# EAGLE design placas_leds (EAGLE 7.7.0)
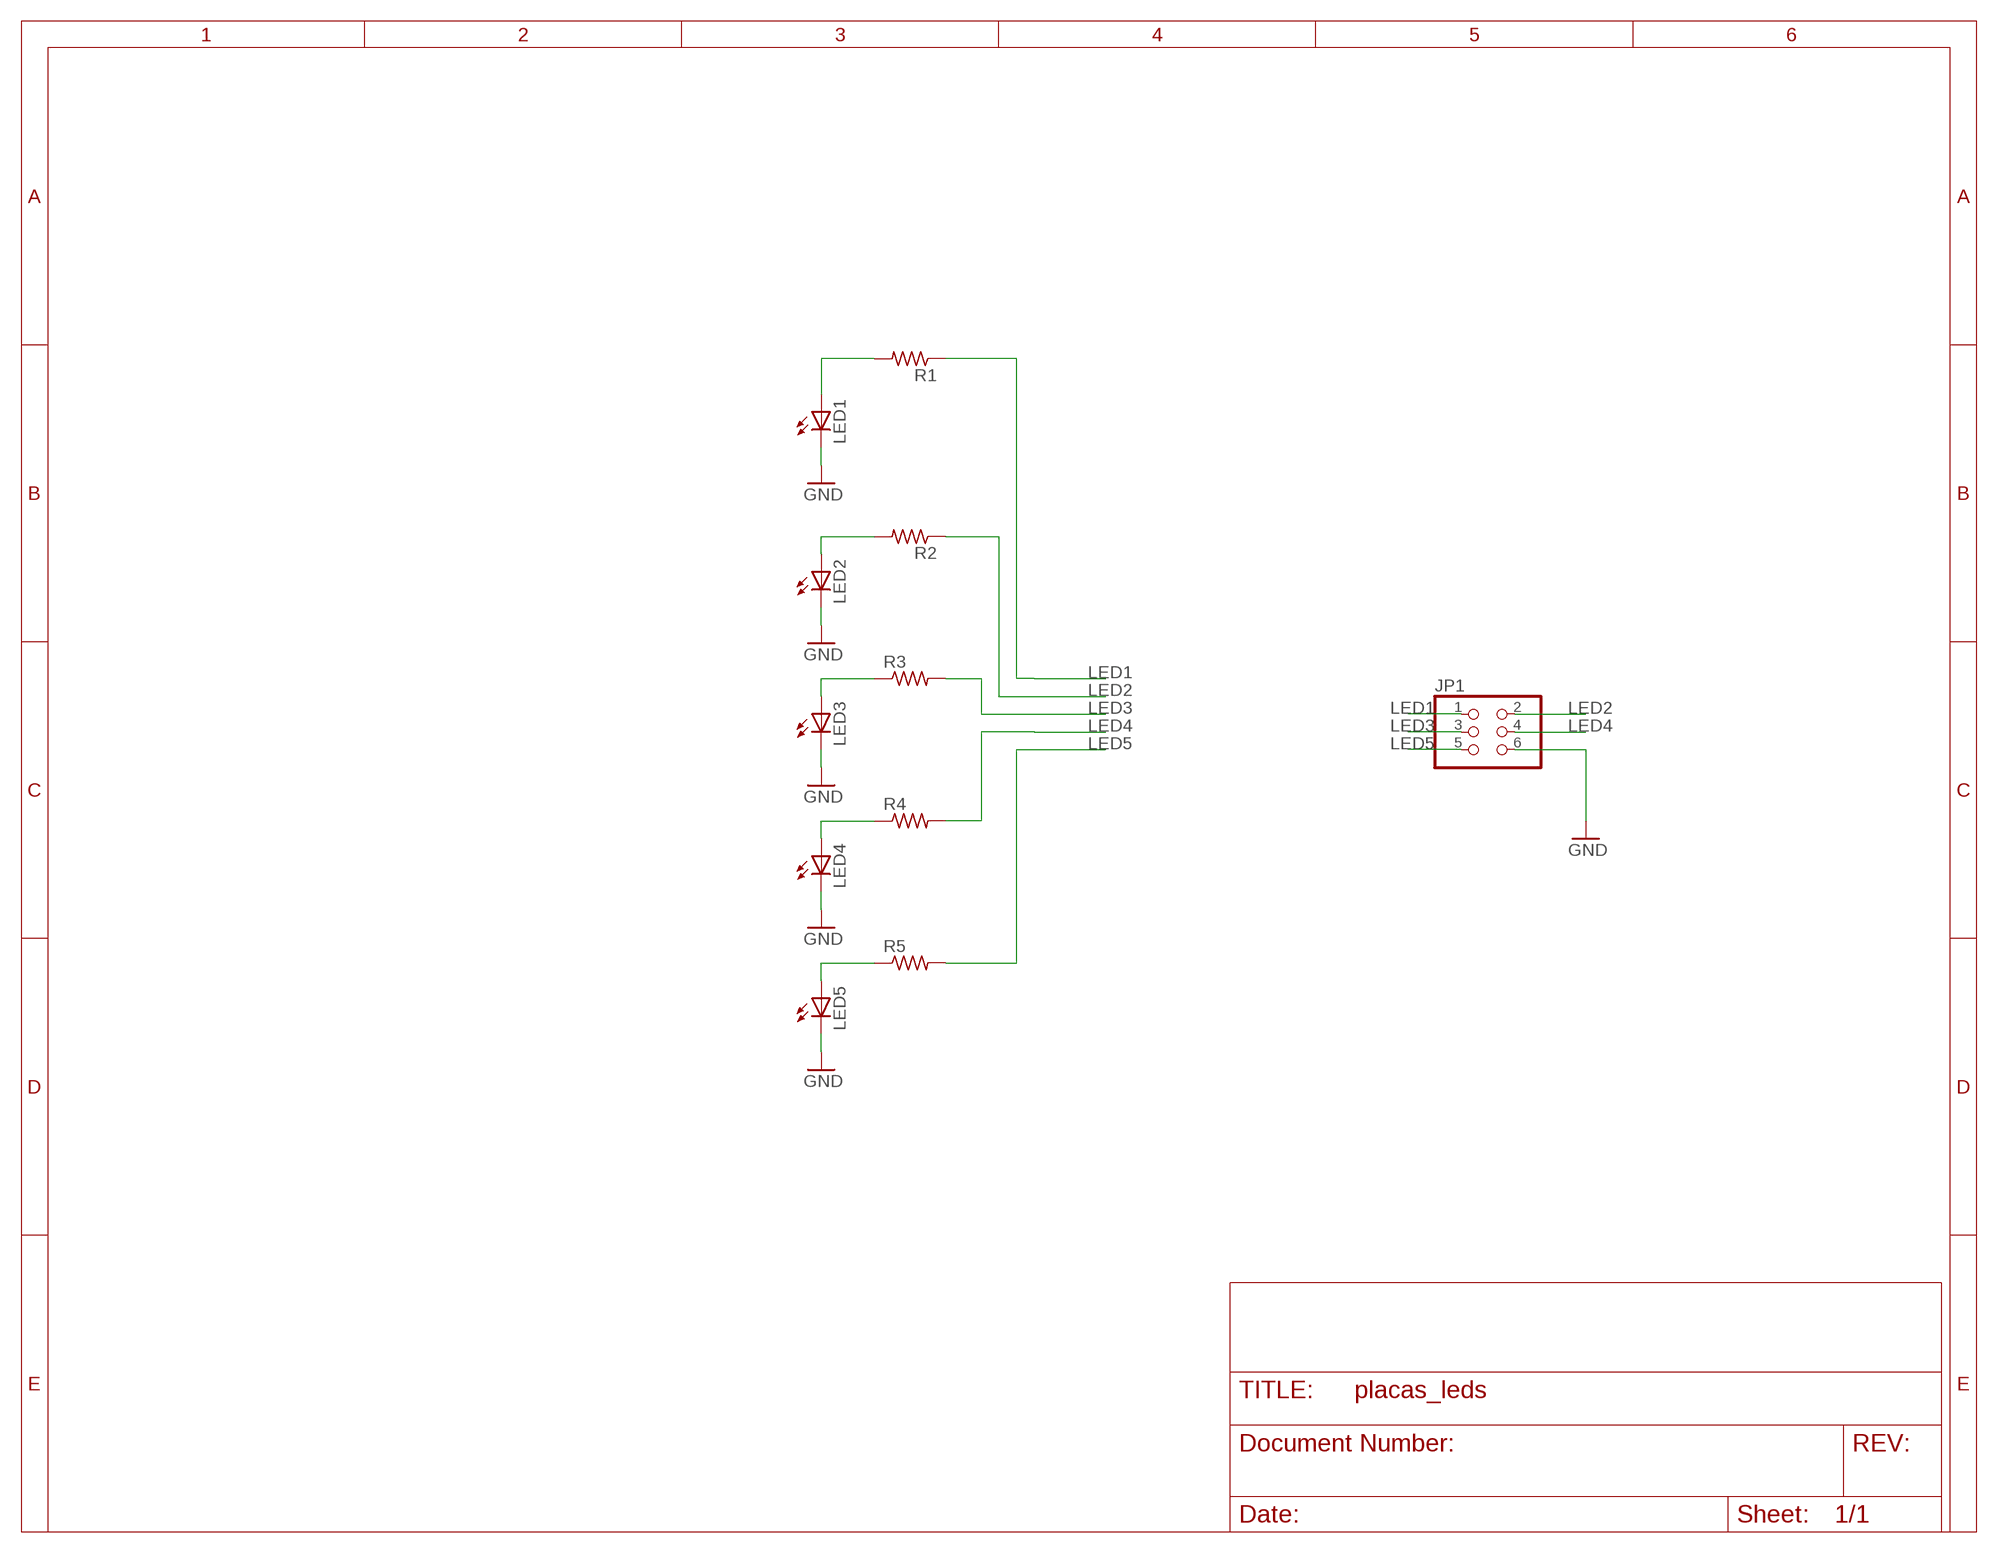
[diagram p0: schematic, sheet 1]

## Parts
JP1  PINHD-2X3  [2X03]
LED1  LED5MM  [LED5MM]
LED2  LED5MM  [LED5MM]
LED3  LED5MM  [LED5MM]
LED4  LED5MM  [LED5MM]
LED5  LED5MM  [LED5MM]
R1  R-US_0207/9  [0207/9]
R2  R-US_0207/9  [0207/9]
R3  R-US_0207/9  [0207/9]
R4  R-US_0207/9  [0207/9]
R5  R-US_0207/9  [0207/9]

## Nets
GND: JP1.6 LED1.K(C) LED2.K(C) LED3.K(C) LED4.K(C) LED5.K(C)
LED1: JP1.1 R1.1
LED2: JP1.2 R2.1
LED3: JP1.3 R3.2
LED4: JP1.4 R4.2
LED5: JP1.5 R5.2
N$1: LED2.A R2.2
N$7: LED1.A R1.2
N$8: LED3.A R3.1
N$9: LED4.A R4.1
N$10: LED5.A R5.1

## Library data of the parts
JP1 = pinhead:PINHD-2X3: PIN HEADER
LED1-LED5 = adafruit:LED: LED OSRAM: - CHIPLED LG R971, LG N971, LY N971, LG Q971, LY Q971, LO R971, LY R971 LH N974, LH R974 LS Q976, LO Q976, LY Q976 LO Q996 - Hyper CHIPLED LW Q18S LB Q993, LB Q99A, LB R99A - SideLED LS A670, LO A670, LY A670, LG A670, LP A670 LB A673, LV A673, LT A673, LW A673 LH A674 LY A675 LS A676, LA A676, LO A676, LY A676, LW A676 LS A679, LY A679, LG A679 - Hyper Micro SIDELED® LS Y876, LA Y876, LO Y876, LY Y876 LT Y87S - SmartLED LW L88C, LW L88S LB L89C, LB L89S, LG L890 LS L89K, LO L89K, LY L89K LS L896, LA L896, LO L896, LY L896 - TOPLED LS T670, LO T670, LY T670, LG T670, LP T670 LSG T670, LSP T670, LSY T670, LOP T670, LYG T670 LG T671, LOG T671, LSG T671 LB T673, LV T673, LT T673, LW T673 LH T674 LS T676, LA T676, LO T676, LY T676, LB T676, LH T676, LSB T676, LW T676 LB T67C, LV T67C, LT T67C, LS T67K, LO T67K, LY T67K, LW E67C LS E67B, LA E67B, LO E67B, LY E67B, LB E67C, LV E67C, LT E67C LW T67C LS T679, LY T679, LG T679 LS T770, LO T770, LY T770, LG T770, LP T770 LB T773, LV T773, LT T773, LW T773 LH T774 LS E675, LA E675, LY E675, LS T675 LS T776, LA T776, LO T776, LY T776, LB T776 LHGB T686 LT T68C, LB T68C - Hyper Mini TOPLED® LB M676 - Mini TOPLED Santana® LG M470 LS M47K, LO M47K, LY M47K Source: http://www.osram.convergy.de/
R1-R5 = adafruit:R-US_: RESISTOR, American symbol

## Board
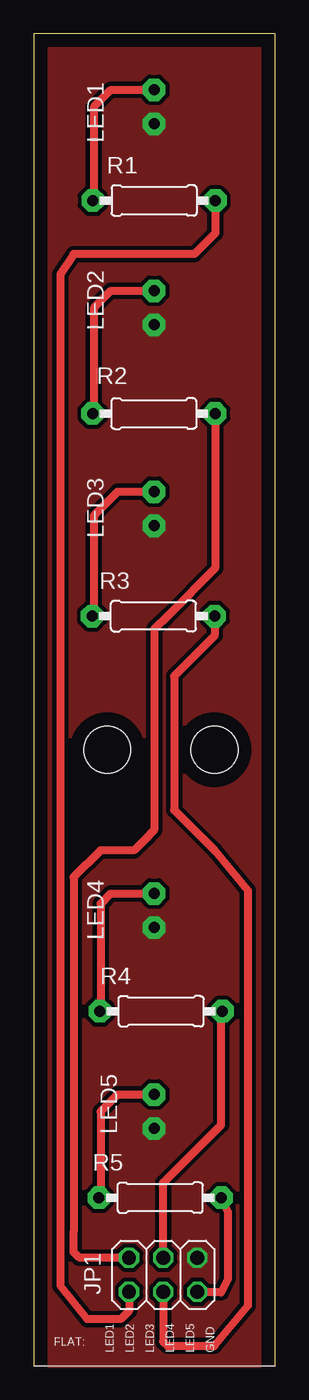
[diagram p1: board, top side]
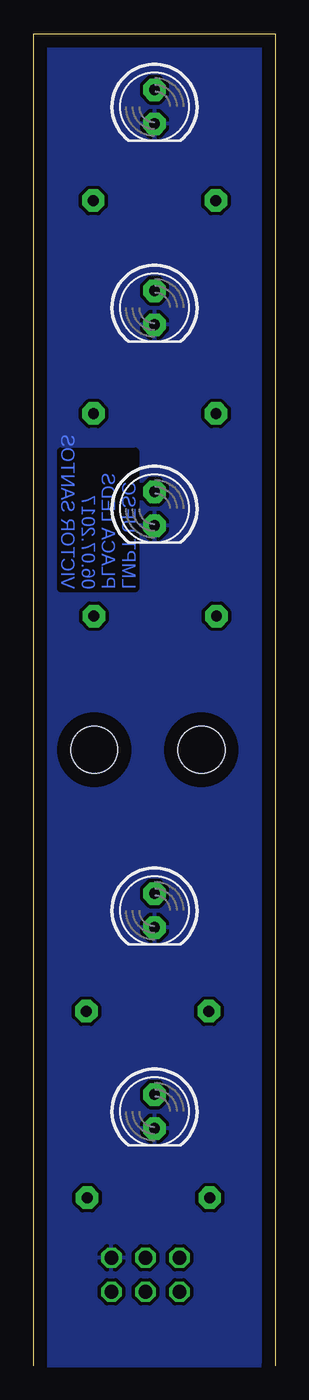
[diagram p2: board, bottom side, seen from below]

Size 18.03 x 99.47 mm. Coordinates in mm from the lower left corner, seen from the top.
Outline: 18.03,0 18.03,99.47 0,99.47 0,0
Copper layers (1*16): Top 0.035mm / dielectric 1.5mm / Bottom 0.035mm
Design rules "default": minimum track width 10mil, minimum drill 24mil, track to track 8mil, track to pad 8mil, pad to pad 8mil, via to via 8mil, smd to smd 8mil, copper to edge 40mil, drill to drill 8mil, minimum pad ring 10mil, minimum via ring 8mil, stop-mask expansion 4mil, vias tented up to drill 0mil, thermal gap 10mil
Holes 3.5 mm at 5.5,46 13.5,46

### Footprints (pad centres in the part's own frame; a part is rotated, then mirrored left to right if it is on the bottom)
2X03 = drill 1.016 octagon: 1 -2.54,-1.27; 2 -2.54,1.27; 3 0,-1.27; 4 0,1.27; 5 2.54,-1.27; 6 2.54,1.27
LED5MM = drill 0.813 pad 1.676 octagon: A -1.27,0; K 1.27,0
0207/9 = drill 0.813 pad 1.676 octagon: 1 -4.572,0; 2 4.572,0

### Placement (x,y rotation side)
JP1  9.68,6.81 0 top
LED1  9,94 270 bottom
LED2  9,79 270 bottom
LED3  9,64 270 bottom
LED4  9,34 270 bottom
LED5  9,19 270 bottom
R1  9,87 180 top
R2  8.98,71.1 180 top
R3  8.95,55.98 0 top
R4  9.52,26.48 0 top
R5  9.45,12.56 0 top

### Tracks (layer width: path | path; a pad name or v marks a point on that pad's centre or on a via)
GND
  pour Bottom (isolate 0.254): 0,99.5 0,0 18,0 18,99.5
  pour Top (isolate 0.305, no thermals): 0,99.5 0,0 18,0 18,99.5
LED1
  Top 0.61: R1.1 13.57,84.57 12,83 3,83 2,81.5 2,6 4,3.5 6.5,3.5 7.14,4.14 JP1.1
LED2
  Top 0.61: R2.1 13.55,59.55 10,56 9,55 9,40 8.25,39.25 | 8.5,39.5 8.25,39.25 | 8.25,39.25 7.5,38.5 5,38.5 3,36.5 3,10 3,8.5 3.42,8.08 JP1.2
LED3
  Top 0.61: JP1.3 9.68,1.82 10,1.5 13.5,1.5 16,4.5 16,35.5 13.52,38.48 10.5,41.5 10.5,51.5 13.52,54.52 R3.2
LED4
  Top 0.61: JP1.4 9.68,13.68 14,18 14,26.39 R4.2
LED5
  Top 0.61: R5.2 14.02,12.48 14.5,11.5 14.5,6.5 14,5.5 12.26,5.5 JP1.5
N$1
  Top 0.61: R2.2 4.5,71.19 4.5,79 5.77,80.27 LED2.A
N$7
  Top 0.61: R1.2 4.5,87.07 4.5,94 5.77,95.27 LED1.A
N$8
  Top 0.61: R3.1 4.5,56.1 4.5,63.5 6.27,65.27 LED3.A
N$9
  Top 0.61: R4.1 5,26.53 5,34.5 5.77,35.27 LED4.A
N$10
  Top 0.61: R5.1 5,12.68 5,19 6.27,20.27 LED5.A

### Text on the board
Bottom: LMPT UFSC / PLACA LEDS / 06.07.2017 / VICTOR SANTOS
tNames: FLAT: | LED1 | LED2 | LED3 | LED4 | LED5 | GND